# Altium project SLAVE_HW.PrjPcb (part 3 of 3)

## Sheet [3]Temperatures.SchDoc
size A4; DocumentNumber: 4; SheetNumber: 4; SheetTotal: 5
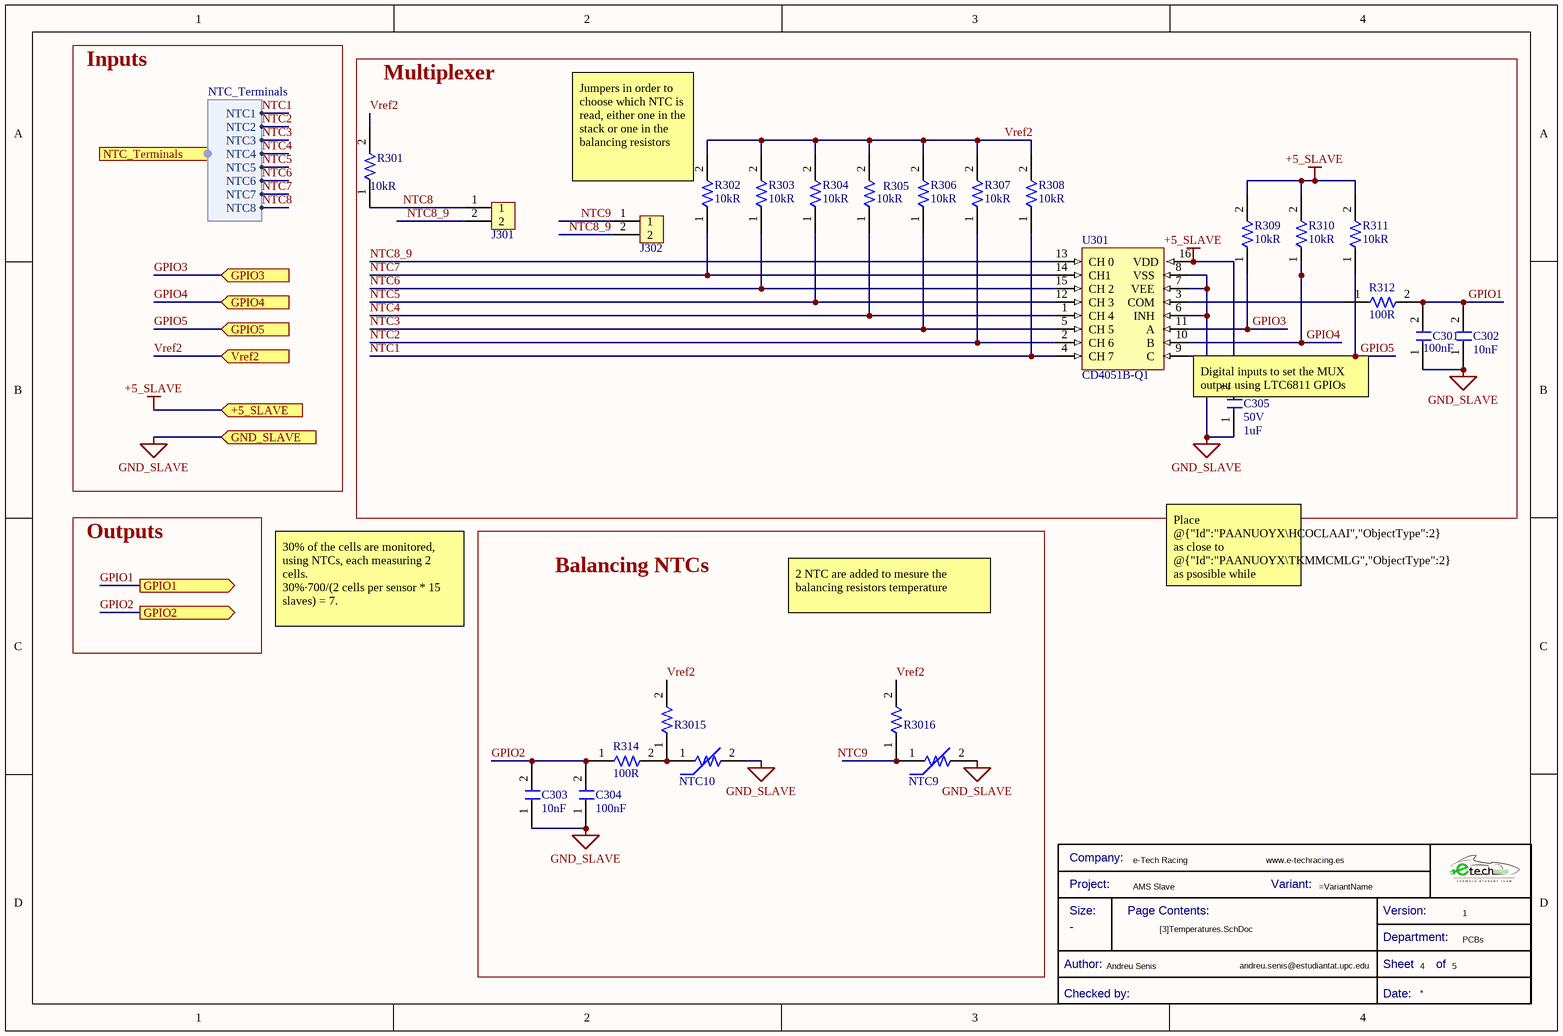
[diagram p2: [3]Temperatures.SchDoc]

### Parts
(Parts that share a designator on the sheet are numbered #1, #2 ... from top to bottom, then left to right.)
*?#1  Title Block_template  (value not drawn)  (graphical)
C301  Capacitance: 100nF  [C0805FNPC-R]  (hidden comment: 885012207128)
C302  Capacitance: 10nF  [C0805FNPC-R]  (hidden comment: 885012207122)
C303  Capacitance: 10nF  [C0805FNPC-R]  (hidden comment: 885012207122)
C304  Capacitance: 100nF  [C0805FNPC-R]  (hidden comment: 885012207128)
C305  Voltage Rating: 50V  Capacitance: 1uF  [C0805FNPC-R]  (hidden comment: 885012207103)
J301  61300211121  [J_Pinheader_1x2]  (value not drawn)
J302  61300211121  [J_Pinheader_1x2]  (value not drawn)
NTC9  NTCS0805E3104SMT  [R0805FTK]  (value not drawn)
NTC10  NTCS0805E3104SMT  [R0805FTK]  (value not drawn)
R301  Resistance: 10kR  [R0805FTK]  (hidden comment: CR0805-JW-103ELF)
R302  Resistance: 10kR  [R0805FTK]  (hidden comment: CR0805-JW-103ELF)
R303  Resistance: 10kR  [R0805FTK]  (hidden comment: CR0805-JW-103ELF)
R304  Resistance: 10kR  [R0805FTK]  (hidden comment: CR0805-JW-103ELF)
R305  Resistance: 10kR  [R0805FTK]  (hidden comment: CR0805-JW-103ELF)
R306  Resistance: 10kR  [R0805FTK]  (hidden comment: CR0805-JW-103ELF)
R307  Resistance: 10kR  [R0805FTK]  (hidden comment: CR0805-JW-103ELF)
R308  Resistance: 10kR  [R0805FTK]  (hidden comment: CR0805-JW-103ELF)
R309  Resistance: 10kR  [R0805FTK]  (hidden comment: CR0805-JW-103ELF)
R310  Resistance: 10kR  [R0805FTK]  (hidden comment: CR0805-JW-103ELF)
R311  Resistance: 10kR  [R0805FTK]  (hidden comment: CR0805-JW-103ELF)
R312  Resistance: 100R  [R0805FTK]  (hidden comment: CR0805-FX-1000ELF)
R314  Resistance: 100R  [R0805FTK]  (hidden comment: CR0805-FX-1000ELF)
R3015  CR0805-FX-1000ELF  [R0805FTK]  (value not drawn)
R3016  CR0805-FX-1000ELF  [R0805FTK]  (value not drawn)
U301  CD4051B-Q1  [CD4051B-Q1]

### Blocks framed on the sheet
Multiplexer: C301 C302 C305 J301 J302 R301-R312 U301
Balancing NTCs: C303 C304 NTC9 NTC10 R314 R3015 R3016

### Ports
+5_SLAVE (in), GND_SLAVE (in), GPIO1 (out), GPIO2 (out), GPIO3 (in), GPIO4 (in), GPIO5 (in), NTC_Terminals (harness NTC_Terminals), Vref2 (in)

### Harnesses
NTC_Terminals: NTC1, NTC2, NTC3, NTC4, NTC5, NTC6, NTC7, NTC8

### Nets
+5_SLAVE: C305.2 R309.2 R310.2 R311.2 U301.16(VDD) ; port +5_SLAVE  [project net Vreg]
GND_SLAVE: C301.1 C302.1 C303.1 C304.1 C305.1 NTC9.2 NTC10.2 U301.6(INH) U301.7(VEE) U301.8(VSS) ; port GND_SLAVE
GPIO1: C301.2 C302.2 R312.2 ; port GPIO1
GPIO2: C303.2 C304.2 R314.1 ; port GPIO2
GPIO3: R309.1 U301.11(A) ; port GPIO3
GPIO4: R310.1 U301.10(B) ; port GPIO4
GPIO5: R311.1 U301.9(C) ; port GPIO5
NTC1: R308.1 U301.4(CH_7) ; port NTC_Terminals.NTC1
NTC2: R307.1 U301.2(CH_6) ; port NTC_Terminals.NTC2
NTC3: R306.1 U301.5(CH_5) ; port NTC_Terminals.NTC3
NTC4: R305.1 U301.1(CH_4) ; port NTC_Terminals.NTC4
NTC5: R304.1 U301.12(CH_3) ; port NTC_Terminals.NTC5
NTC6: R303.1 U301.15(CH_2) ; port NTC_Terminals.NTC6
NTC7: R302.1 U301.14(CH1) ; port NTC_Terminals.NTC7
NTC8: J301.1 R301.1 ; port NTC_Terminals.NTC8
NTC8_9: J301.2 J302.2 U301.13(CH_0)
NTC9: J302.1 NTC9.1 R3016.1
Vref2: R301.2 R302.2 R303.2 R304.2 R305.2 R306.2 R307.2 R308.2 R3015.2 R3016.2 ; port Vref2
NetNTC10_1: NTC10.1 R314.2 R3015.1
NetR312_1: R312.1 U301.3(COM)

### Notes on the sheet
- Inputs
- (near R302) Jumpers in order to choose which NTC is read, either one in the stack or one in the balancing resistors
- (near C305) Digital inputs to set the MUX output using LTC6811 GPIOs
- Outputs
- Place @{"Id":"PAANUOYX\HCOCLAAI","ObjectType":2}  as close to @{"Id":"PAANUOYX\TKMMCMLG","ObjectType":2} as psosible while @{"Id":"PAANUOYX\ZTOLZYSZ","ObjectType":2} to @{"Id":"PAANUOYX\UERQLFQA","ObjectType":2} as close to @{"Id":"DMDIIFGR\EDJCIAWA"} as possible.
- 30% of the cells are monitored, using NTCs, each measuring 2 cells.                                                 30%·700/(2 cells per sensor * 15 slaves) = 7.
- 2 NTC are added to mesure the balancing resistors temperature
- (in symbol Title Block_template) Company:; Project:; Variant:; Size:; Page Contents:; Version:; Department:; Author:; Sheet; of; Checked by:; Date:

### Library data of the parts
*?#1 = Title Block_template: Standard Title Block; .Creator: GP; Category: Title Block; .PCBcheck: GP; .SCHcheck: GP; Size: -
C301 C304 = C100n-100V-0805FNPC-X7R: 0.1μF ±10% 100V Ceramic Capacitor X7R 0805 (2012 Metric); Manufacturer 1: Wurth Electronics; Manufacturer Part Number 1: 885012207098; Voltage Rating: 50V; .Creator: DR; Material: 4241ConductorMaterial; Insulation Resistance: 1GR; Supplier 1: RSComponents; RoHS: Yes; Category: Ceramic Capacitors; Stock 1: 8000; Pricing 1: 100=0,10200, 500=0,07100, 2000=0,06100 (GBP); Mount: Surface Mount; Case/Package: 0805; Case Code (Metric): 2012; Case Code (Imperial): 0805; Min Operating Temperature: -55°C; Max Operating Temperature: 125°C; Packaging: Cut Tape; Dielectric: X7R; Tolerance: 10%; Voltage Rating (DC): 50V; Length: 0.079inch; Width: 0.049inch; Thickness: 0.035inch; REACH SVHC: Unknown; RoHS Compliant: Yes; ComponentLink1URL: http://www.farnell.com/datasheets/1958498.pdf?src-supplier=Farnell; ComponentLink1Description: http://www.farnell.com/datasheets/1958498.pdf?src-supplier=Farnell; ComponentLink2URL: http://www.farnell.com/datasheets/1958498.pdf?src-supplier=Element14; ComponentLink2Description: http://www.farnell.com/datasheets/1958498.pdf?src-supplier=Element14; ComponentLink3URL: https://katalog.we-online.de/pbs/datasheet/885012207098.pdf?src-supplier=Digi-Key; ComponentLink3Description: https://katalog.we-online.de/pbs/datasheet/885012207098.pdf?src-supplier=Digi-Key; ComponentLink4URL: http://www.farnell.com/datasheets/1958498.pdf?src-supplier=Newark; ComponentLink4Description: http://www.farnell.com/datasheets/1958498.pdf?src-supplier=Newark; Supplier Part Number 1: 1813493; Supplier 2: Digi-Key; Manufacturer: Wurth Electronics; Manufacturer Part Number: 885012207128; Stock 2: 19198; Pricing 2: 1=0,1, 10=0,088, 100=0,078, 500=0,069 (USD); Height: 1.25mm; ComponentLink5URL: http://www.farnell.com/datasheets/2546917.pdf?src-supplier=Farnell; ComponentLink5Description: http://www.farnell.com/datasheets/2546917.pdf?src-supplier=Farnell; ComponentLink6URL: http://www.farnell.com/datasheets/2546917.pdf?src-supplier=Element14; ComponentLink6Description: http://www.farnell.com/datasheets/2546917.pdf?src-supplier=Element14; ComponentLink7URL: http://www.farnell.com/datasheets/2546917.pdf?src-supplier=Newark; ComponentLink7Description: http://www.farnell.com/datasheets/2546917.pdf?src-supplier=Newark; ComponentLink8URL: https://katalog.we-online.de/pbs/datasheet/885012207128.pdf?src-supplier=Digi-Key; ComponentLink8Description: https://katalog.we-online.de/pbs/datasheet/885012207128.pdf?src-supplier=Digi-Key; Supplier Part Number 2: 732-12244-1-ND
C302 C303 = C10n-100V-0805FNPC-X7R: Cap Cer 10000PF 100V X7R 0805; Manufacturer 1: Wurth Electronics; Manufacturer Part Number 1: 885012207092; Voltage Rating: 50V; Tolerance: 10%; .Creator: DR; Value: 10nF; Insulation Resistance: 10GR; RoHS: Yes; Category: Ceramic Capacitors; Stock 1: 1; Pricing 1: 4000=0,03200, 12000=0,03100 (USD); Mount: Surface Mount; Case/Package: 0805; Case Code (Metric): 2012; Case Code (Imperial): 0805; Min Operating Temperature: -55°C; Max Operating Temperature: 125°C; Packaging: Cut Tape; Dielectric: X7R; Voltage Rating (DC): 50V; Length: 0.079inch; Width: 0.049inch; Thickness: 0.035inch; REACH SVHC: Unknown; RoHS Compliant: Yes; ComponentLink1URL: http://www.farnell.com/datasheets/1958497.pdf?src-supplier=Farnell; ComponentLink1Description: http://www.farnell.com/datasheets/1958497.pdf?src-supplier=Farnell; ComponentLink2URL: http://www.farnell.com/datasheets/1958497.pdf?src-supplier=Element14; ComponentLink2Description: http://www.farnell.com/datasheets/1958497.pdf?src-supplier=Element14; ComponentLink3URL: http://www.farnell.com/datasheets/1958497.pdf?src-supplier=Newark; ComponentLink3Description: http://www.farnell.com/datasheets/1958497.pdf?src-supplier=Newark; ComponentLink4URL: https://katalog.we-online.de/pbs/datasheet/885012207092.pdf?src-supplier=Digi-Key; ComponentLink4Description: https://katalog.we-online.de/pbs/datasheet/885012207092.pdf?src-supplier=Digi-Key; Manufacturer: Wurth Electronics; Manufacturer Part Number: 885012207122; Stock 2: 7435; Pricing 2: 1=0,1, 10=0,043, 100=0,039, 500=0,034 (USD); Height: 800um; ComponentLink5URL: http://www.farnell.com/datasheets/2546912.pdf?src-supplier=Farnell; ComponentLink5Description: http://www.farnell.com/datasheets/2546912.pdf?src-supplier=Farnell; ComponentLink6URL: http://www.farnell.com/datasheets/2546912.pdf?src-supplier=Newark; ComponentLink6Description: http://www.farnell.com/datasheets/2546912.pdf?src-supplier=Newark; ComponentLink7URL: https://katalog.we-online.de/pbs/datasheet/885012207122.pdf?src-supplier=Digi-Key; ComponentLink7Description: https://katalog.we-online.de/pbs/datasheet/885012207122.pdf?src-supplier=Digi-Key; Supplier 1: Digi-Key; Supplier Part Number 1: 732-12139-1-ND
C305 = C1u-50V-0805FNPC-X7R: Multilayer Ceramic Capacitor, Wcap-Csgp Series, 1 F, 10%, X7R, 50 V, 0805 [2012 Metric] Rohs Compliant: Yes; Manufacturer 1: Wurth Electronics; .Creator: GP; Supplier 1: RSComponents; Manufacturer Part Number 1: 885012207103; RoHS: Yes; Category: Ceramic Capacitors; Stock 1: 5100; Pricing 1: 50=0,27200, 250=0,25300, 500=0,22800, 1250=0,20100, 2500=0,17100 (GBP); Mount: Surface Mount; Case/Package: 0805; Case Code (Metric): 2012; Case Code (Imperial): 0805; Min Operating Temperature: -55°C; Max Operating Temperature: 85°C; Packaging: Cut Tape; Dielectric: X7R; Tolerance: 10%; Voltage Rating (DC): 50V; Length: 0.079inch; Width: 0.049inch; Thickness: 0.053inch; REACH SVHC: Unknown; RoHS Compliant: Yes; ComponentLink1URL: http://www.farnell.com/datasheets/1958501.pdf?src-supplier=Farnell; ComponentLink1Description: http://www.farnell.com/datasheets/1958501.pdf?src-supplier=Farnell; ComponentLink2URL: http://www.farnell.com/datasheets/1958501.pdf?src-supplier=Element14; ComponentLink2Description: http://www.farnell.com/datasheets/1958501.pdf?src-supplier=Element14; ComponentLink3URL: https://katalog.we-online.de/pbs/datasheet/885012107003.pdf?src-supplier=Digi-Key; ComponentLink3Description: https://katalog.we-online.de/pbs/datasheet/885012107003.pdf?src-supplier=Digi-Key; ComponentLink4URL: http://www.farnell.com/datasheets/1958501.pdf?src-supplier=Newark; ComponentLink4Description: http://www.farnell.com/datasheets/1958501.pdf?src-supplier=Newark; Supplier Part Number 1: 1813523
J301 J302 = J_Jumper: CONN HEADER 2 POS 2.54; Manufacturer: Molex; Temperature rating: -40° to +105°C; Category type: PCB-PCB; Product name: Pin Header; Maximum current: 3 A; Maximum voltage: 250 V AC; Connections: 1x2; Current Rating: 3A; Voltage Rating: 250V; Number of Positions: 2; Gender: Male; Connector Type: Male Pin; Pitch: 0.1inch; .Creator: GP; Category: Connector; ComponentLink1Description: Datasheet; ComponentLink1URL: https://www.we-online.com/catalog/datasheet/61300211121.pdf; ComponentLink2Description: Where buy it; ComponentLink2URL: https://www.we-online.com/catalog/en/PHD_2_54_THT_PIN_HEADER_6130XX11121?sq=61300211121&sp=https%3A%2F%2Fwww.we-online.com%2Fweb%2Fen%2Fwuerth_elektronik%2Fsearchpage.php%3Fsearch%3D61300211121#61300211121; Manufacturer part number: 61300211121; Supplier: Würth Elektronik; RoHS: *; Application: Shortcircuit; Flammability: 94V-0; Orientation: Vertical; Mount: Through hole; Supplier 1: RSComponents; Stock 1: 1855; Pricing 1: 5=0,14100, 50=0,09700, 100=0,07800, 200=0,07300, 500=0,06800 (USD); Contact Plating: Gold; Housing Material: PBT; Contact Material: Copper Alloy,Copper; Color: Black; Min Operating Temperature: -40°C; Max Operating Temperature: 125°C; Number of Rows: 1; Contact Gender: Male; Packaging: Bulk; Termination: Through Hole; Number of Contacts: 2; Contact Mating Length: 0.236inch; REACH SVHC: Unknown; Lead Free: Lead Free; ComponentLink3URL: https://datasheet.ciiva.com/13619/6130xx11121-48870-13619345.pdf?src-supplier=Mouser; ComponentLink3Description: https://datasheet.ciiva.com/13619/6130xx11121-48870-13619345.pdf?src-supplier=Mouser; Supplier Part Number 1: 8281581
NTC9 NTC10 = NTC_SMD_100KR: NTC Thermistors, NTC SMD 0805 NiSn 100K 1% medium B e3 | Vishay Dale NTCS0805E3104SMT; Manufacturer: Vishay BCcomponents; Supplier 1: Farnell; Manufacturer Part Number: NTCS0805E3104SMT; RoHS: Yes; Category: Linear ICs; Stock 1: 9; Pricing 1: 10=0,889, 100=0,605, 500=0,509, 1000=0,454, 2000=0,42, 4000=0,385, 20000=0,371, 40000=0,364 (EUR); ComponentLink1URL: http://www.mouser.com/ds/2/427/ntcse3smt-537144.pdf?src-supplier=Mouser; ComponentLink1Description: http://www.mouser.com/ds/2/427/ntcse3smt-537144.pdf?src-supplier=Mouser; ComponentLink2URL: http://www.farnell.com/datasheets/2046093.pdf?src-supplier=Farnell; ComponentLink2Description: http://www.farnell.com/datasheets/2046093.pdf?src-supplier=Farnell; ComponentLink3URL: https://datasheet.octopart.com/NTCS0805E3104SMT-Vishay-datasheet-62318405.pdf?src-supplier=Newark; ComponentLink3Description: https://datasheet.octopart.com/NTCS0805E3104SMT-Vishay-datasheet-62318405.pdf?src-supplier=Newark; ComponentLink4URL: http://www.farnell.com/datasheets/2046093.pdf?src-supplier=Element14; ComponentLink4Description: http://www.farnell.com/datasheets/2046093.pdf?src-supplier=Element14; ComponentLink5URL: http://www.vishay.com/docs/29044/ntcs0805e3t.pdf?src-supplier=Avnet; ComponentLink5Description: http://www.vishay.com/docs/29044/ntcs0805e3t.pdf?src-supplier=Avnet; ComponentLink6URL: http://www.vishay.com/docs/29119/ntcse3t.pdf?src-supplier=Digikey; ComponentLink6Description: http://www.vishay.com/docs/29119/ntcse3t.pdf?src-supplier=Digikey; ComponentLink7URL: http://www.vishay.com/docs/29151/ntcse3smt.pdf?src-supplier=Digikey; ComponentLink7Description: http://www.vishay.com/docs/29151/ntcse3smt.pdf?src-supplier=Digikey; Supplier Part Number 1: 2473599
R301-R311 = R10k-0805FTK: BOURNS         CR0805-JW-103ELF            Surface Mount Chip Resistor, Thick Film, CR Series, 10 kohm, 125 mW,  5%, 150 V; Temperature Coefficient: 200ppm/°C; Power Rating: 125mW; Voltage Rating: 150V; Voltage Rating (DC): 100V; .Creator: DR; Supplier 1: Arrow Electronics; Manufacturer 1: Bourns; Manufacturer Part Number 1: CR0805-JW-103ELF; RoHS: Yes; Category: Chip SMD Resistors; Stock 1: 57566; Pricing 1: 1=0,05790, 10=0,01540, 25=0,01340, 100=0,00340 (USD); Mount: Surface Mount; Case/Package: 0805; Number of Pins: 2; Contact Plating: Tin; Case Code (Metric): 2012; Case Code (Imperial): 0805; Min Operating Temperature: -55°C; Max Operating Temperature: 155°C; Tolerance: 5%; Resistor Type: Thick Film; Package Quantity: 1; Packaging: Tape and Reel; Number of Terminations: 2; Termination: SMD/SMT; Max Power Dissipation: 125mW; Features: Moisture Resistant; Series: CR0805; Construction: Rectangular; Resistance Tolerance: 5%; Technology: THICK FILM; Length: 2mm; Width: 1.25mm; Height: 0.5mm; Depth: 1.25mm; Thickness: 508um; Radiation Hardening: No; REACH SVHC: No SVHC; Military Standard: Not; RoHS Compliant: Yes; ComponentLink1URL: https://datasheet.ciiva.com/11821/0900766b80fcdb72-11821135.pdf?src-supplier=RSComponents; ComponentLink1Description: https://datasheet.ciiva.com/11821/0900766b80fcdb72-11821135.pdf?src-supplier=RSComponents; ComponentLink2URL: https://datasheet.ciiva.com/9122/chpreztr-9122374.pdf?src-supplier=Avnet; ComponentLink2Description: https://datasheet.ciiva.com/9122/chpreztr-9122374.pdf?src-supplier=Avnet; ComponentLink3URL: https://datasheet.ciiva.com/22693/1902866-22693254.pdf?src-supplier=Element14; ComponentLink3Description: https://datasheet.ciiva.com/22693/1902866-22693254.pdf?src-supplier=Element14; ComponentLink4URL: https://datasheet.ciiva.com/7986/691949-7986187.pdf?src-supplier=Element14; ComponentLink4Description: https://datasheet.ciiva.com/7986/691949-7986187.pdf?src-supplier=Element14; ComponentLink5URL: https://datasheet.ciiva.com/30065/159chpreztr-30065976.pdf?src-supplier=Onlinecomponents.com; ComponentLink5Description: https://datasheet.ciiva.com/30065/159chpreztr-30065976.pdf?src-supplier=Onlinecomponents.com; ComponentLink6URL: https://datasheet.ciiva.com/16783/70154685-16783482.pdf?src-supplier=Allied+Electronics; ComponentLink6Description: https://datasheet.ciiva.com/16783/70154685-16783482.pdf?src-supplier=Allied+Electronics; ComponentLink7URL: https://datasheet.ciiva.com/5548/chpreztr-5548491.pdf?src-supplier=Mouser; ComponentLink7Description: https://datasheet.ciiva.com/5548/chpreztr-5548491.pdf?src-supplier=Mouser; ComponentLink8URL: https://datasheet.ciiva.com/6559/chpreztr-6559900.pdf?src-supplier=Digi-Key; ComponentLink8Description: https://datasheet.ciiva.com/6559/chpreztr-6559900.pdf?src-supplier=Digi-Key; ComponentLink9URL: https://datasheet.ciiva.com/6559/chpreztr-6559901.pdf?src-supplier=Digi-Key; ComponentLink9Description: https://datasheet.ciiva.com/6559/chpreztr-6559901.pdf?src-supplier=Digi-Key; ComponentLink10URL: https://datasheet.ciiva.com/7985/1856384-7985869.pdf?src-supplier=Element14; ComponentLink10Description: https://datasheet.ciiva.com/7985/1856384-7985869.pdf?src-supplier=Element14; ComponentLink11URL: https://datasheet.ciiva.com/48692/001055517-da-01-en-smd-wid-cr0805-jw-103elf-10k-ohm-1-8w-48692118.pdf?src-supplier=Conrad; ComponentLink11Description: https://datasheet.ciiva.com/48692/001055517-da-01-en-smd-wid-cr0805-jw-103elf-10k-ohm-1-8w-48692118.pdf?src-supplier=Conrad; Supplier Part Number 1: CR0805-JW-103ELF
R312 R314 = R100-0805FTK: Res Thick Film 0805 100 Ohm 1% 1/8W ±100ppm/°C Molded SMD SMD Paper Tape on Plastic Reel; Manufacturer 1: Bourns; Power Rating: 125mW; Voltage Rating: 150V; .Creator: DR; Supplier 1: Arrow Electronics; Manufacturer Part Number 1: CR0805-FX-1000ELF; RoHS: Yes; Category: Chip SMD Resistors; Stock 1: 49802; Pricing 1: 1=0,05840, 10=0,03430, 25=0,01780, 100=0,00750, 250=0,00560, 500=0,00490, 3000=0,00470 (USD); Mount: Surface Mount; Case/Package: 0805; Number of Pins: 2; Contact Plating: Tin; Case Code (Imperial): 0805; Case Code (Metric): 2012; Min Operating Temperature: -55°C; Max Operating Temperature: 155°C; Tolerance: 1%; Resistor Type: Thick Film; Temperature Coefficient: 100ppm/°C; Packaging: Tape and Reel; Package Quantity: 1; Termination: SMD/SMT; Number of Terminations: 2; Max Power Dissipation: 125mW; Voltage Rating (DC): 150V; Features: Moisture Resistant; Series: CR0805; Resistance Tolerance: 1%; Construction: Rectangular; Technology: THICK FILM; Length: 2mm; Width: 1.25mm; Height: 0.5mm; Depth: 1.25mm; Thickness: 508um; Radiation Hardening: No; REACH SVHC: No SVHC; Military Standard: Not; RoHS Compliant: Yes; ComponentLink1URL: https://datasheet.ciiva.com/11809/0900766b80fcdb72-11809178.pdf?src-supplier=RSComponents; ComponentLink1Description: https://datasheet.ciiva.com/11809/0900766b80fcdb72-11809178.pdf?src-supplier=RSComponents; ComponentLink2URL: https://datasheet.ciiva.com/6547/chpreztr-6547413.pdf?src-supplier=Digi-Key; ComponentLink2Description: https://datasheet.ciiva.com/6547/chpreztr-6547413.pdf?src-supplier=Digi-Key; ComponentLink3URL: https://datasheet.ciiva.com/6547/chpreztr-6547414.pdf?src-supplier=Digi-Key; ComponentLink3Description: https://datasheet.ciiva.com/6547/chpreztr-6547414.pdf?src-supplier=Digi-Key; ComponentLink4URL: https://datasheet.ciiva.com/6547/chpreztr-6547415.pdf?src-supplier=Digi-Key; ComponentLink4Description: https://datasheet.ciiva.com/6547/chpreztr-6547415.pdf?src-supplier=Digi-Key; ComponentLink5URL: https://datasheet.ciiva.com/9120/chpreztr-9120744.pdf?src-supplier=Avnet; ComponentLink5Description: https://datasheet.ciiva.com/9120/chpreztr-9120744.pdf?src-supplier=Avnet; Supplier Part Number 1: CR0805-FX-1000ELF
R3015 R3016 = R100K-0805FTK: Res Thick Film 0805 100 Ohm 1% 1/8W ±100ppm/°C Molded SMD SMD Paper Tape on Plastic Reel; Voltage Rating: 150V; Max Power Dissipation: 125mW; .Creator: DR; Packaging: Tape and Reel; Package Quantity: 1; Termination: SMD/SMT; Number of Terminations: 2; Voltage Rating (DC): 150V; Features: Moisture Resistant; Series: CR0805; Resistance Tolerance: 1%; Construction: Rectangular; Technology: THICK FILM; Length: 2mm; Width: 1.25mm; Height: 0.5mm; Depth: 1.25mm; Thickness: 508um; Radiation Hardening: No; REACH SVHC: No SVHC; Military Standard: Not; RoHS Compliant: Yes; Supplier Part Number 1: CR0805-FX-1000ELF
U301 = CD4051B-Q1: CD4053B-Q1 Automotive Cmos Tripl; Manufacturer: Texas Instruments; Manufacturer Part Number: CD4053BQM96G4Q1; Min Supply Voltage: 5V; Max Supply Voltage: 20V; Number of Channels: 3; Bandwidth: 30MHz; Propagation Delay: 20ns; Number of Inputs: 6; Min Dual Supply Voltage: 2.5V; Max Dual Supply Voltage: 10V; Operating Supply Current: 80nA; Number of Bits: 2; Supplier 1: Mouser; RoHS: Yes; Category: Interface ICs; Stock 1: 7075; Pricing 1: 1=0,75, 10=0,617, 50=0,617, 100=0,468, 1000=0,319, 10000=0,258 (USD); Mounting Technology: Surface Mount; Case/Package: SOIC; Pins: 16; Weight: 0.004998oz; Contact Plating: Gold; Min Operating Temperature: -40°C; Max Operating Temperature: 125°C; Packaging: Tape and Reel; Package Quantity: 2500; Series: Automotive, AEC-Q100; Number of Outputs: 3; Number of Circuits: 3; -3db Bandwidth: 30MHz; Lead Free: Lead Free; RoHS Compliant: Yes; ComponentLink1URL: https://datasheet.ciiva.com/1671/cd4053b-q1-1671196.pdf?src-supplier=Digi-Key; ComponentLink1Description: https://datasheet.ciiva.com/1671/cd4053b-q1-1671196.pdf?src-supplier=Digi-Key; ComponentLink2URL: https://datasheet.ciiva.com/1671/cd4053b-q1-1671195.pdf?src-supplier=Digi-Key; ComponentLink2Description: https://datasheet.ciiva.com/1671/cd4053b-q1-1671195.pdf?src-supplier=Digi-Key; ComponentLink3URL: https://datasheet.ciiva.com/1671/cd4053b-q1-1671197.pdf?src-supplier=Digi-Key; ComponentLink3Description: https://datasheet.ciiva.com/1671/cd4053b-q1-1671197.pdf?src-supplier=Digi-Key; ComponentLink4URL: https://datasheet.ciiva.com/14435/cd4053b-q1-14435722.pdf?src-supplier=Avnet; ComponentLink4Description: https://datasheet.ciiva.com/14435/cd4053b-q1-14435722.pdf?src-supplier=Avnet; Supplier Part Number 1: 595-CD4053BQM96G4Q1

## Sheet [4]Communication.SchDoc
size A4; DocumentNumber: 5; SheetNumber: 5; SheetTotal: 5
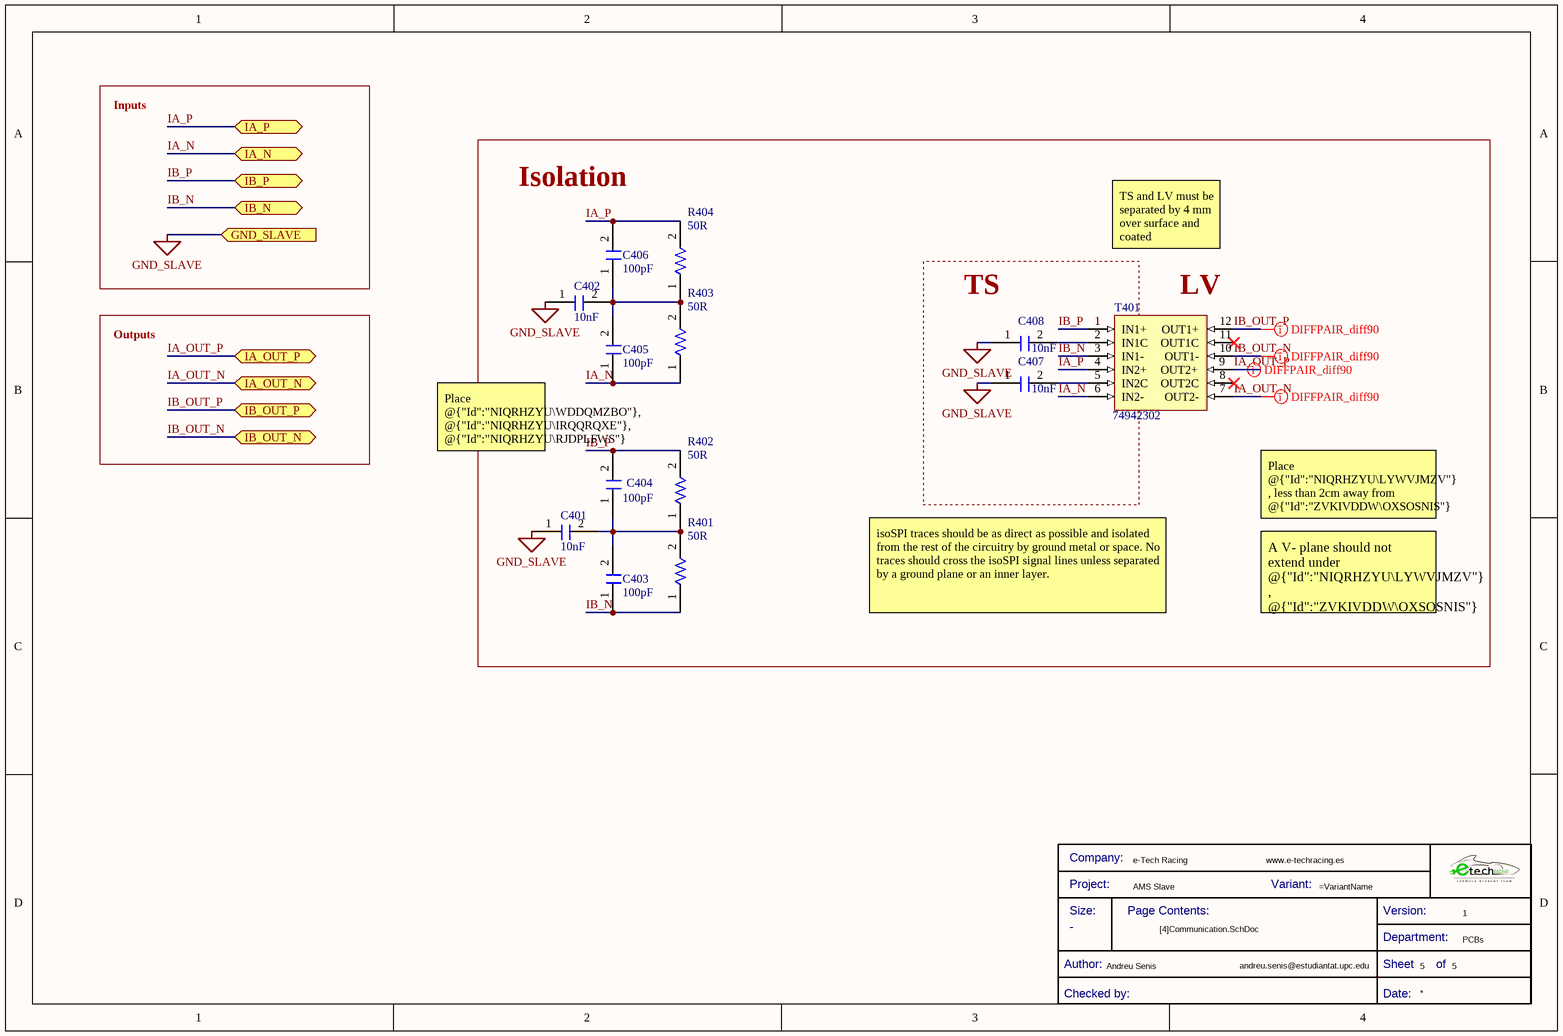
[diagram p3: [4]Communication.SchDoc]

### Parts
(Parts that share a designator on the sheet are numbered #1, #2 ... from top to bottom, then left to right.)
*?#2  Title Block_template  (value not drawn)  (graphical)
C401  Capacitance: 10nF  [C0805FNPC-R]  (hidden comment: 885012207122)
C402  Capacitance: 10nF  [C0805FNPC-R]  (hidden comment: 885012207122)
C403  Capacitance: 100pF  [C0805FNPC-W]  (hidden comment: 885012007082)
C404  Capacitance: 100pF  [C0805FNPC-W]  (hidden comment: 885012007082)
C405  Capacitance: 100pF  [C0805FNPC-W]  (hidden comment: 885012007082)
C406  Capacitance: 100pF  [C0805FNPC-W]  (hidden comment: 885012007082)
C407  Capacitance: 10nF  [C0805FNPC-R]  (hidden comment: 885012207122)
C408  Capacitance: 10nF  [C0805FNPC-R]  (hidden comment: 885012207122)
R401  50R  [R0805FTK]
R402  50R  [R0805FTK]
R403  50R  [R0805FTK]
R404  50R  [R0805FTK]
T401  74942302  [TFMR_74942302]

### Blocks framed on the sheet
TS: C407 C408

### Ports
GND_SLAVE (in), IA_N (bidir), IA_OUT_N (bidir), IA_OUT_P (bidir), IA_P (bidir), IB_N (bidir), IB_OUT_N (bidir), IB_OUT_P (bidir), IB_P (bidir)

### Nets
GND_SLAVE: C401.1 C402.1 C407.1 C408.1 ; port GND_SLAVE
IA_N: C405.1 R403.1 T401.6(IN2-) ; port IA_N
IA_OUT_N: T401.7(OUT2-) ; port IA_OUT_N
IA_OUT_P: T401.9(OUT2+) ; port IA_OUT_P
IA_P: C406.2 R404.2 T401.4(IN2+) ; port IA_P
IB_N: C403.1 R401.1 T401.3(IN1-) ; port IB_N
IB_OUT_N: T401.10(OUT1-) ; port IB_OUT_N
IB_OUT_P: T401.12(OUT1+) ; port IB_OUT_P
IB_P: C404.2 R402.2 T401.1(IN1+) ; port IB_P
NetC401_2: C401.2 C403.2 C404.1 R401.2 R402.1
NetC402_2: C402.2 C405.2 C406.1 R403.2 R404.1
NetC407_2: C407.2 T401.5(IN2C)
NetC408_2: C408.2 T401.2(IN1C)

Not connected (* = marked no-connect by the designer): T401 8(OUT2C)* 11(OUT1C)*

### Layout directives
differential pair; differential pair class diff90: IA_OUT_N, IA_OUT_P, IB_OUT_N, IB_OUT_P

### Notes on the sheet
- Inputs
- Isolation
- TS and LV must be separated by 4 mm over surface and coated
- (near T401) LV
- Outputs
- Place @{"Id":"NIQRHZYU\WDDQMZBO"}, @{"Id":"NIQRHZYU\IRQQRQXE"}, @{"Id":"NIQRHZYU\RJDPLFWS"} and @{"Id":"NIQRHZYU\UZNONKUP"} as close to @{"Id":"DMDIIFGR\EDJCIAWA"} as possible.
- Place @{"Id":"NIQRHZYU\LYWVJMZV"} , less than 2cm away from @{"Id":"ZVKIVDDW\OXSOSNIS"} and @{"Id":"ZVKIVDDW\EPOQRVEM"} . @{"Id":"DMDIIFGR\EDJCIAWA"} shoud be close but at lest 1-2 cm away from the @{"Id":"NIQRHZYU\LYWVJMZV"}
- isoSPI traces should be as direct as possible and isolated from the rest of the circuitry by ground metal or space. No traces should cross the isoSPI signal lines unless separated by a ground plane or an inner layer.
- A V- plane should not extend under @{"Id":"NIQRHZYU\LYWVJMZV"} , @{"Id":"ZVKIVDDW\OXSOSNIS"} , @{"Id":"ZVKIVDDW\EPOQRVEM"} or between them.
- (in symbol Title Block_template) Company:; Project:; Variant:; Size:; Page Contents:; Version:; Department:; Author:; Sheet; of; Checked by:; Date:

### Library data of the parts
*?#2 = Title Block_template: Standard Title Block; .Creator: GP; Category: Title Block; .PCBcheck: GP; .SCHcheck: GP; Size: -
C401 C402 C407 C408 = C10n-100V-0805FNPC-X7R: as C302 on sheet [3]Temperatures; Supplier 1: RSComponents; RoHS: Yes; Category: Ceramic Capacitors; Stock 1: 1; Pricing 1: 4000=0,03200, 12000=0,03100 (USD); Mount: Surface Mount; Case/Package: 0805; Case Code (Metric): 2012; Case Code (Imperial): 0805; Min Operating Temperature: -55°C; Max Operating Temperature: 125°C; Packaging: Cut Tape; Dielectric: X7R; Voltage Rating (DC): 50V; Length: 0.079inch; Width: 0.049inch; Thickness: 0.035inch; REACH SVHC: Unknown; RoHS Compliant: Yes; ComponentLink1URL: http://www.farnell.com/datasheets/1958497.pdf?src-supplier=Farnell; ComponentLink1Description: http://www.farnell.com/datasheets/1958497.pdf?src-supplier=Farnell; ComponentLink2URL: http://www.farnell.com/datasheets/1958497.pdf?src-supplier=Element14; ComponentLink2Description: http://www.farnell.com/datasheets/1958497.pdf?src-supplier=Element14; ComponentLink3URL: http://www.farnell.com/datasheets/1958497.pdf?src-supplier=Newark; ComponentLink3Description: http://www.farnell.com/datasheets/1958497.pdf?src-supplier=Newark; ComponentLink4URL: https://katalog.we-online.de/pbs/datasheet/885012207092.pdf?src-supplier=Digi-Key; ComponentLink4Description: https://katalog.we-online.de/pbs/datasheet/885012207092.pdf?src-supplier=Digi-Key; Supplier Part Number 1: 1813941; Supplier 2: Digi-Key; Manufacturer: Wurth Electronics; Manufacturer Part Number: 885012207122; Stock 2: 7435; Pricing 2: 1=0,1, 10=0,043, 100=0,039, 500=0,034 (USD); Height: 800um; ComponentLink5URL: http://www.farnell.com/datasheets/2546912.pdf?src-supplier=Farnell; ComponentLink5Description: http://www.farnell.com/datasheets/2546912.pdf?src-supplier=Farnell; ComponentLink6URL: http://www.farnell.com/datasheets/2546912.pdf?src-supplier=Newark; ComponentLink6Description: http://www.farnell.com/datasheets/2546912.pdf?src-supplier=Newark; ComponentLink7URL: https://katalog.we-online.de/pbs/datasheet/885012207122.pdf?src-supplier=Digi-Key; ComponentLink7Description: https://katalog.we-online.de/pbs/datasheet/885012207122.pdf?src-supplier=Digi-Key; Supplier Part Number 2: 732-12139-1-ND
C403-C406 = C100p-100V-0805FNPC-C0G/NP0: Cap Cer 100PF 100V C0G/NP0 0805; Manufacturer: Wurth Electronics; Manufacturer Part Number: 885012007057; Voltage Rating: 50V; Dielectric: C0G; Tolerance: 5%; .Creator: DR; Supplier 1: RSComponents; RoHS: Yes; Category: Ceramic Capacitors; Stock 1: 1; Pricing 1: 4000=0,03900, 12000=0,03800 (USD); Mount: Surface Mount; Case/Package: 0805; Case Code (Metric): 2012; Case Code (Imperial): 0805; Min Operating Temperature: -55°C; Max Operating Temperature: 125°C; Packaging: Cut Tape; Voltage Rating (DC): 50V; Length: 0.079inch; Width: 0.049inch; Thickness: 0.035inch; REACH SVHC: Unknown; RoHS Compliant: Yes; ComponentLink1URL: http://www.farnell.com/datasheets/1958443.pdf?src-supplier=Farnell; ComponentLink1Description: http://www.farnell.com/datasheets/1958443.pdf?src-supplier=Farnell; ComponentLink2URL: https://katalog.we-online.de/pbs/datasheet/885012007057.pdf?src-supplier=Digi-Key; ComponentLink2Description: https://katalog.we-online.de/pbs/datasheet/885012007057.pdf?src-supplier=Digi-Key; ComponentLink3URL: http://www.farnell.com/datasheets/1958443.pdf?src-supplier=Element14; ComponentLink3Description: http://www.farnell.com/datasheets/1958443.pdf?src-supplier=Element14; ComponentLink4URL: http://www.farnell.com/datasheets/1958443.pdf?src-supplier=Newark; ComponentLink4Description: http://www.farnell.com/datasheets/1958443.pdf?src-supplier=Newark; ComponentLink5Description: Where buy it; ComponentLink5URL: https://www.we-online.com/catalog/en/WCAP-CSGP-50VDC#885012007057; Supplier Part Number 1: 1813930; Supplier 2: Digi-Key; Stock 2: 3490; Pricing 2: 1=0,1, 10=0,066, 100=0,06, 500=0,053 (USD); ComponentLink6URL: https://katalog.we-online.de/pbs/datasheet/885012007082.pdf?src-supplier=Digi-Key; ComponentLink6Description: https://katalog.we-online.de/pbs/datasheet/885012007082.pdf?src-supplier=Digi-Key; Supplier Part Number 2: 732-12228-1-ND
R401-R404 = R50-0805FTK_1: Res Thick Film 0805 50 Ohm 1% 0.125W(1/8W) ±100ppm/C Pad SMD Automotive T/R; Manufacturer: Vishay Dale; Manufacturer Part Number: CRCW080550R0FKTA; Power Rating: 125mW; Voltage Rating: 150V; Temperature Coefficient: 100ppm/°C; Supplier 1: Mouser; RoHS: No; Category: Chip SMD Resistors; Stock 1: 38245; Pricing 1: 1=0,25, 10=0,204, 50=0,204, 100=0,08, 1000=0,033, 10000=0,026 (USD); ComponentLink1URL: https://datasheet.ciiva.com/48525/dcrcw-48525895.pdf?src-supplier=Avnet; ComponentLink1Description: https://datasheet.ciiva.com/48525/dcrcw-48525895.pdf?src-supplier=Avnet; Supplier Part Number 1: 71-CRCW0805-50; Case/Package: 0805; Weight: 0.000194oz; Case Code (Imperial): 0805; Case Code (Metric): 2012; Contact Plating: Tin,Lead; Min Operating Temperature: -55°C; Max Operating Temperature: 155°C; Value: 50R; Tolerance: 1%; Packaging: Tape and Reel; Package Quantity: 5000; Series: CRCW; Length: 2mm; Width: 1.25mm; Height: 0.45mm; Lead Free: Contains Lead; RoHS Compliant: No
T401 = TFMR_4300V_1min_74942302

## Nets that join several sheets
GND_SLAVE: [2]Balancing (24 pins), [3]Temperatures (10 pins), [4]Communication (C401.1 C402.1 C407.1 C408.1)
Vreg: [2]Balancing (5 pins), [3]Temperatures (5 pins)
Cell0: [1]SLAVE_HW (J101.1), [2]Balancing (L200.2 L201.1)
Cell1: [1]SLAVE_HW (J101.2), [2]Balancing (L202.1)
Cell2: [1]SLAVE_HW (J101.3), [2]Balancing (L203.1)
Cell3: [1]SLAVE_HW (J101.4), [2]Balancing (L204.1)
Cell4: [1]SLAVE_HW (J101.5), [2]Balancing (L205.1)
Cell5: [1]SLAVE_HW (J101.6), [2]Balancing (L206.1)
Cell6: [1]SLAVE_HW (J101.7), [2]Balancing (L207.1)
Cell7: [1]SLAVE_HW (J101.8), [2]Balancing (L208.1)
Cell8: [1]SLAVE_HW (J101.9), [2]Balancing (L209.1)
Cell9: [1]SLAVE_HW (J101.10), [2]Balancing (L210.1)
Cell10: [1]SLAVE_HW (J101.11), [2]Balancing (L211.1)
Cell11: [1]SLAVE_HW (J101.12), [2]Balancing (L212.1)
Cell12: [1]SLAVE_HW (J101.13), [2]Balancing (L213.1 L214.1)
GPIO1: [2]Balancing (U201.27), [3]Temperatures (C301.2 C302.2 R312.2)
GPIO2: [2]Balancing (U201.28), [3]Temperatures (C303.2 C304.2 R314.1)
GPIO3: [2]Balancing (U201.29), [3]Temperatures (R309.1 U301.11)
GPIO4: [2]Balancing (U201.32), [3]Temperatures (R310.1 U301.10)
GPIO5: [2]Balancing (U201.33), [3]Temperatures (R311.1 U301.9)
IA_N: [2]Balancing (U201.41), [4]Communication (C405.1 R403.1 T401.6)
IA_OUT_N: [1]SLAVE_HW (J104.2), [4]Communication (T401.7)
IA_OUT_P: [1]SLAVE_HW (J104.1), [4]Communication (T401.9)
IA_P: [2]Balancing (U201.42), [4]Communication (C406.2 R404.2 T401.4)
IB_N: [2]Balancing (U201.47), [4]Communication (C403.1 R401.1 T401.3)
IB_OUT_N: [1]SLAVE_HW (J103.2), [4]Communication (T401.10)
IB_OUT_P: [1]SLAVE_HW (J103.1), [4]Communication (T401.12)
IB_P: [2]Balancing (U201.48), [4]Communication (C404.2 R402.2 T401.1)
NTC1: [1]SLAVE_HW (J102.1), [3]Temperatures (R308.1 U301.4)
NTC2: [1]SLAVE_HW (J102.2), [3]Temperatures (R307.1 U301.2)
NTC3: [1]SLAVE_HW (J102.3), [3]Temperatures (R306.1 U301.5)
NTC4: [1]SLAVE_HW (J102.4), [3]Temperatures (R305.1 U301.1)
NTC5: [1]SLAVE_HW (J102.5), [3]Temperatures (R304.1 U301.12)
NTC6: [1]SLAVE_HW (J102.6), [3]Temperatures (R303.1 U301.15)
NTC7: [1]SLAVE_HW (J102.7), [3]Temperatures (R302.1 U301.14)
NTC8: [1]SLAVE_HW (J102.8), [3]Temperatures (J301.1 R301.1)
Vref2: [2]Balancing (C227.2 U201.34), [3]Temperatures (10 pins)